# EAGLE design door_sensor (EAGLE 7.3.0)
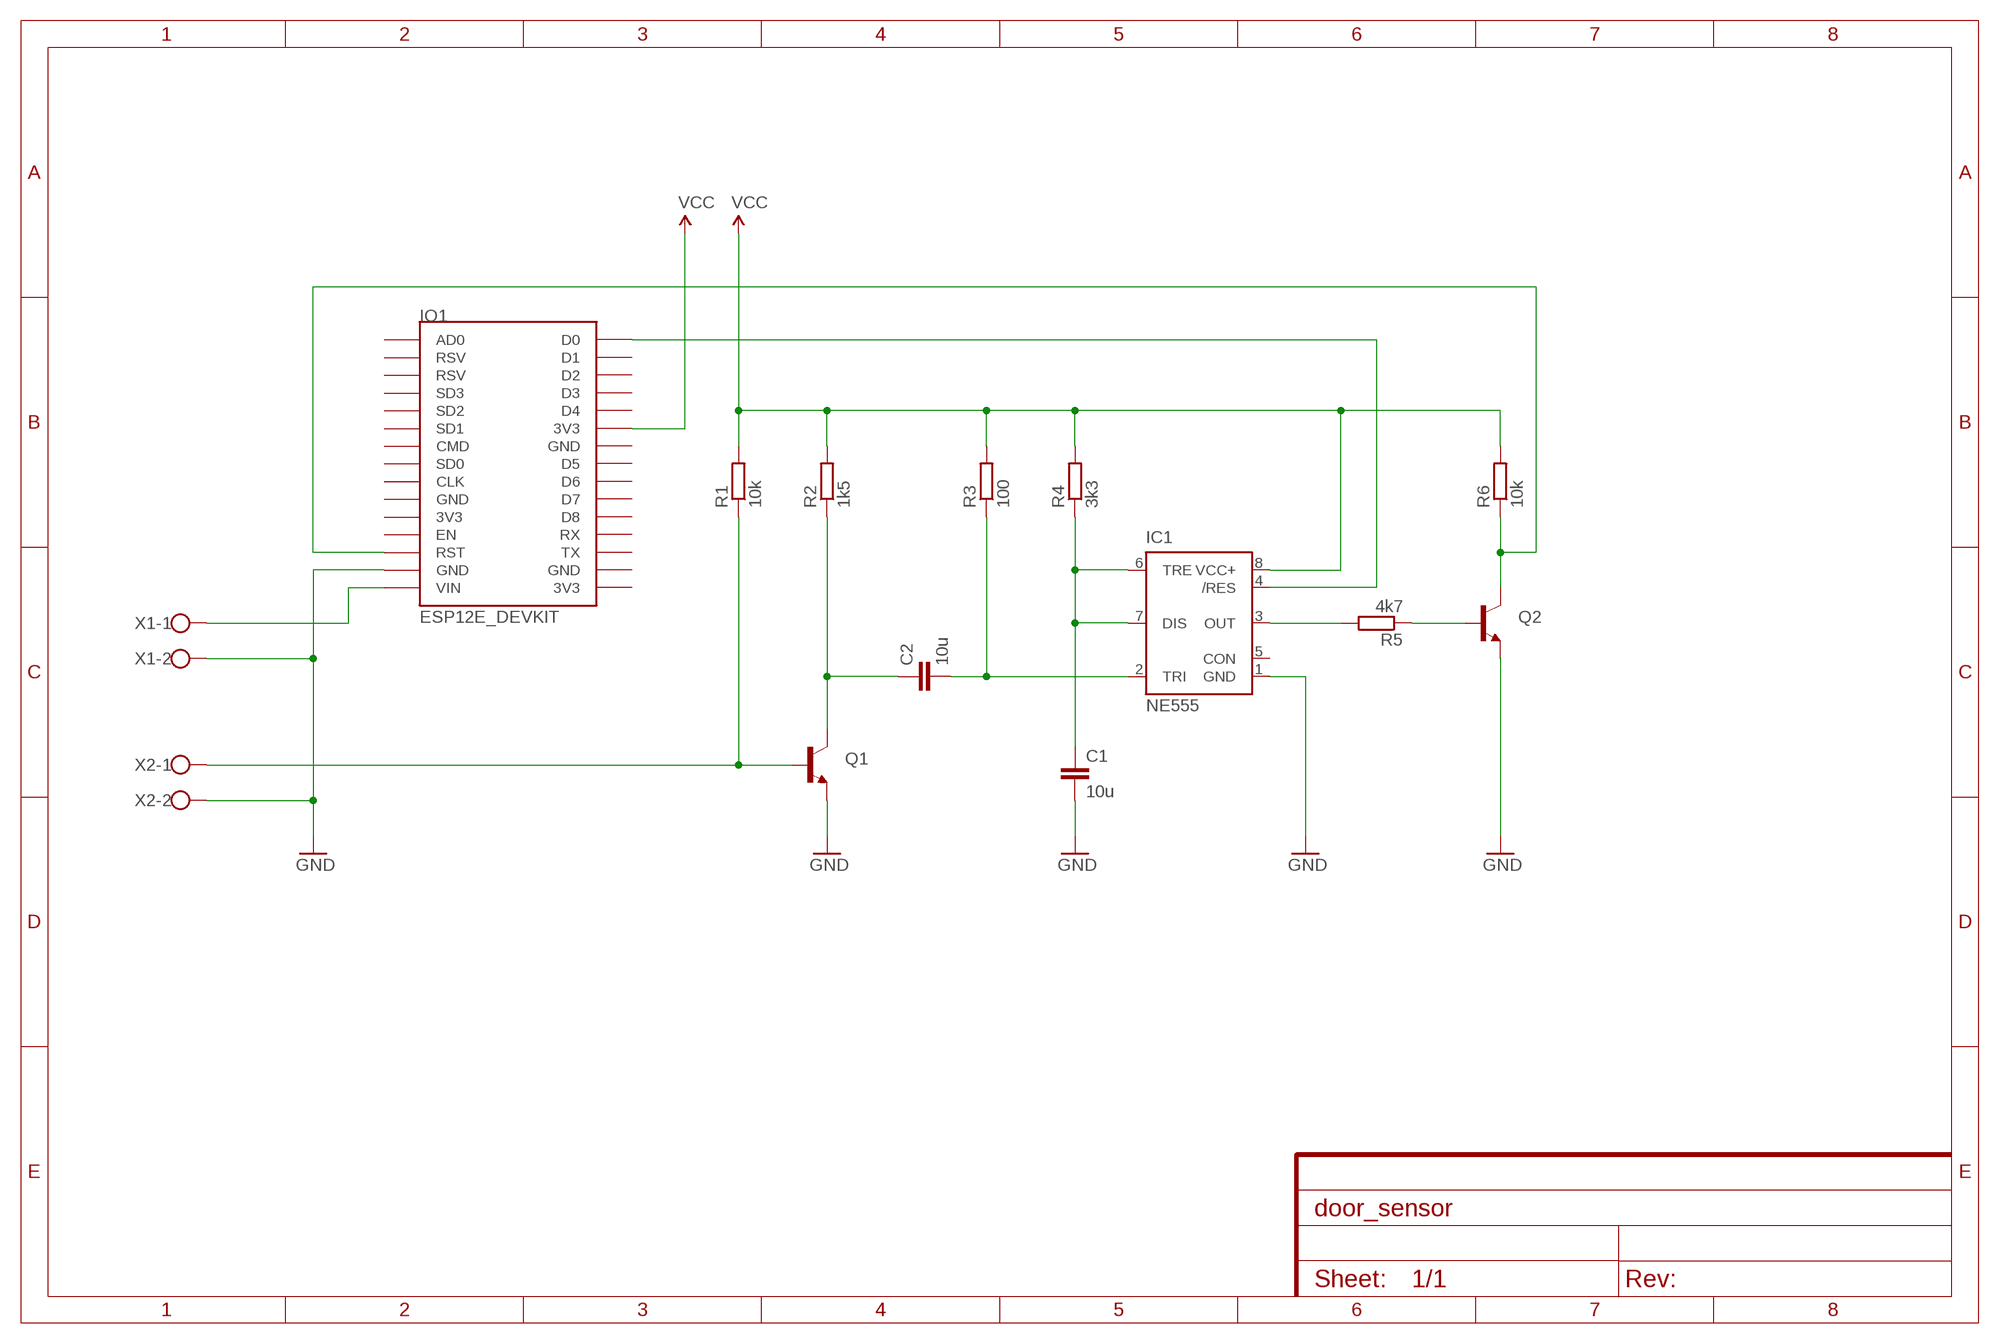
[diagram p0: schematic, sheet 1]
FRAME1 (FRAME-A4L): CNAME: Door sensor; CREVISION: 1; DESIGNER: M.Vagovszky

## Parts
C1  10u  C-EU025-025X050  [C025-025X050]
C2  10u  C-EU025-025X050  [C025-025X050]
IC1  NE555  [DIL-08]
IO1  ESP12E_DEVKIT  [ESP12E_DEVKIT]
Q1  TRANSISTOR_NPN2N3904  [TO-92]
Q2  TRANSISTOR_NPN2N3904  [TO-92]
R1  10k  R-EU_0207/12  [0207/12]
R2  1k5  R-EU_0207/12  [0207/12]
R3  100  R-EU_0207/12  [0207/12]
R4  3k3  R-EU_0207/12  [0207/12]
R5  4k7  R-EU_0207/12  [0207/12]
R6  10k  R-EU_0207/12  [0207/12]
X1  AK550/2  [AK550/2]
X2  AK550/2  [AK550/2]

## Nets
GND: C1.2 IC1.1(GND) IO1.GND@1(GND) Q1.1(E) Q2.1(E) X1.2 X2.2
N$1: C2.1 Q1.3(C) R2.1
N$2: Q1.2(B) R1.1 X2.1
N$3: C2.2 IC1.2(TRI) R3.1
N$4: IO1.VIN X1.1
N$8: IO1.RST Q2.3(C) R6.1
N$9: Q2.2(B) R5.1
N$10: IC1.3(OUT) R5.2
N$11: C1.1 IC1.6(TRE) IC1.7(DIS) R4.1
N$12: IC1.4(/RES) IO1.D0
VCC: IC1.8(VCC+) IO1.3V3@1(3V3) R1.2 R2.2 R3.2 R4.2 R6.2
Unconnected: IC1.5(CON) IO1.3V3@0(3V3) IO1.3V3@2(3V3) IO1.AD0 IO1.CLK IO1.CMD IO1.D1 IO1.D2 IO1.D3 IO1.D4 IO1.D5 IO1.D6 IO1.D7 IO1.D8 IO1.EN IO1.GND@0(GND) IO1.GND@2(GND) IO1.GND@3(GND) IO1.RSV@0(RSV) IO1.RSV@1(RSV) IO1.RX IO1.SD0 IO1.SD1 IO1.SD2 IO1.SD3 IO1.TX

## Library data of the parts
C1 C2 = rcl:C-EU: CAPACITOR, European symbol
IC1 = st-microelectronics:NE555: General purpose bipolar Timer; MF: Arrow Electronics; MPN: NE555N; OC_FARNELL: 1467742; OC_NEWARK: 89K1486
IO1 = esp12e_devkit:ESP12E_DEVKIT: ESP12E DEVKIT BOARD
Q1 Q2 = SparkFun-DiscreteSemi:TRANSISTOR_NPN: Generic NPN BJT MMBT2222A - TRANS-08049 (SOT-23, 1A 40V) MPSA42 - TRANS-09116 (SOT-23, 500mA 300V) MMBT5088LT1G - TRANS-11160 (SOT-23, 50 mA 30V) BC547 - COM-08928 <http://www.sparkfun.com/products/8928> (TO-92 45V 100mA) (1.Collector 2.Base 3.Emitter) 2N3904 - COM-00521 <http://www.sparkfun.com/products/521> (TO-92 40V 200mA) (1.Emitter 2.Base 3.Collector) P2N2222A - COM-12852 <http://www.sparkfun.com/products/12852> (TO-92 40V 600mA) (1.Collector 2.Base 3.Emitter); PROD_ID: TRANS-08447
R1-R6 = rcl:R-EU_: RESISTOR, European symbol
X1 X2 = con-ptr500+:AK550/2: CONNECTOR

## Board
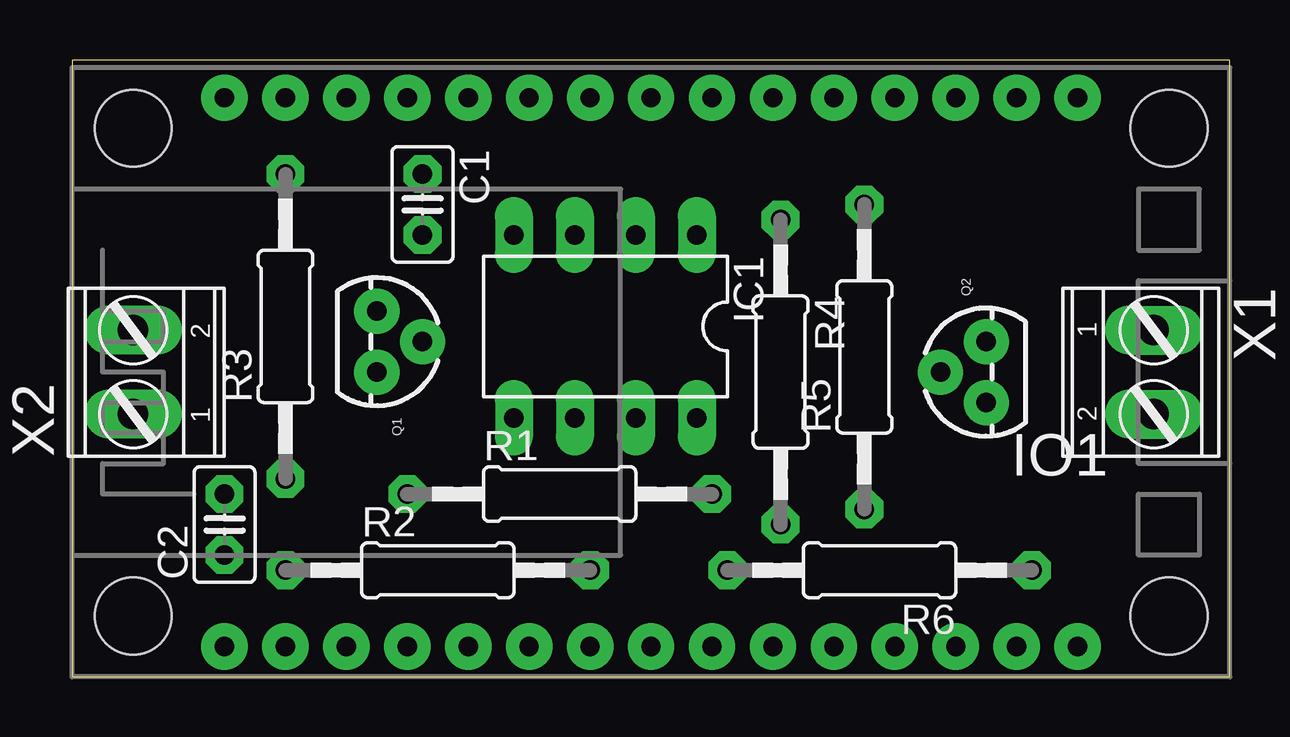
[diagram p1: board, top side]
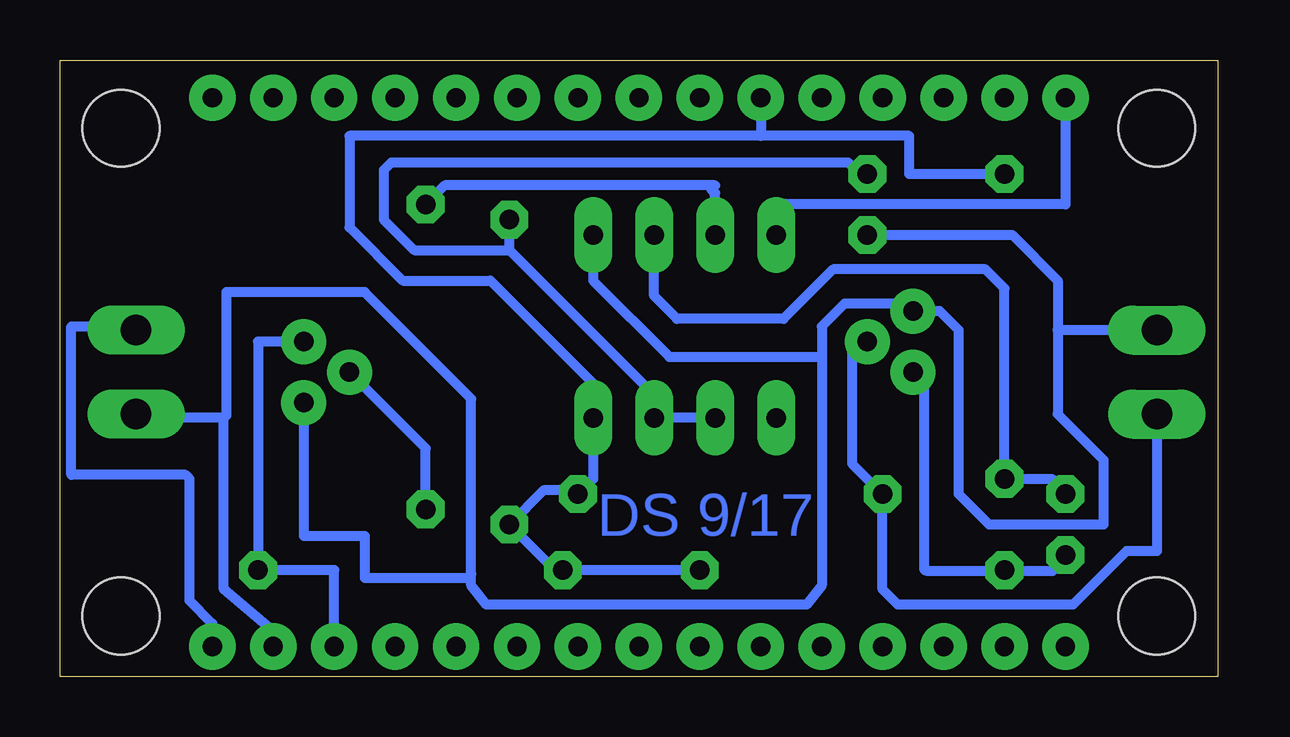
[diagram p2: board, bottom side, seen from below]

Size 48.25 x 25.7 mm. Coordinates in mm from the lower left corner, seen from the top.
Outline: 48.25,0 48.25,25.7 0,25.7 0,0 48.25,0
Copper layers (1*16): Top 0.035mm / dielectric 1.5mm / Bottom 0.035mm
Design rules "default *": minimum track width 10mil, minimum drill 24mil, track to track 8mil, track to pad 8mil, pad to pad 8mil, via to via 8mil, smd to smd 8mil, copper to edge 40mil, drill to drill 8mil, minimum pad ring 15mil, minimum via ring 10mil, stop-mask expansion 4mil, vias tented up to drill 0mil, thermal gap 10mil

### Footprints (pad centres in the part's own frame; a part is rotated, then mirrored left to right if it is on the bottom)
C025-025X050 = drill 0.813 octagon: 1 -1.27,0; 2 1.27,0
DIL-08 = drill 0.813 long: 1 -3.81,-3.81; 2 -1.27,-3.81; 3 1.27,-3.81; 4 3.81,-3.81; 5 3.81,3.81; 6 1.27,3.81; 7 -1.27,3.81; 8 -3.81,3.81
ESP12E_DEVKIT = drill 0.8 pad 1.93: 3V3@0 -11.43,-7.62; 3V3@1 11.43,5.08; 3V3@2 11.43,-17.78; AD0 -11.43,17.78; CLK -11.43,-2.54; CMD -11.43,2.54; D0 11.43,17.78; D1 11.43,15.24; D2 11.43,12.7; D3 11.43,10.16; D4 11.43,7.62; D5 11.43,0; D6 11.43,-2.54; D7 11.43,-5.08; D8 11.43,-7.62; EN -11.43,-10.16; GND@0 -11.43,-5.08; GND@1 -11.43,-15.24; GND@2 11.43,2.54; GND@3 11.43,-15.24; RST -11.43,-12.7; RSV@0 -11.43,15.24; RSV@1 -11.43,12.7; RX 11.43,-10.16; SD0 -11.43,0; SD1 -11.43,5.08; SD2 -11.43,7.62; SD3 -11.43,10.16; TX 11.43,-12.7; VIN -11.43,-17.78 | hole 3.2: -10.16,21.59; 10.16,21.59; 10.16,-21.59; -10.16,-21.59
TO-92 = drill 0.813 pad 1.88: 1 -1.27,0; 2 0,1.905; 3 1.27,0
0207/12 = drill 0.813 octagon: 1 -6.35,0; 2 6.35,0
AK550/2 = drill 1.27 long: 1 -1.75,0; 2 1.75,0

### Placement (x,y rotation side)
C1  14.6,19.68 270 top
C2  6.34,6.35 90 top
IC1  22.21,14.61 180 top
IO1  24.12,12.7 90 top
Q1  12.69,13.97 270 top
Q2  38.09,12.7 90 top
R1  20.31,7.62 0 top
R2  15.23,4.45 0 top
R3  8.88,14.61 90 top
R4  29.52,12.7 270 top
R5  33.01,13.34 90 top
R6  33.65,4.45 180 top
X1  45.08,12.7 270 top
X2  2.53,12.7 90 top

### Tracks (layer width: path | path; a pad name or v marks a point on that pad's centre or on a via)
GND
  Bottom 0.254: 12.82,15.32 Q1.1
  Bottom 0.406: 41.42,10.79 41.32,10.9 41.32,16.03 35.55,16.03 31.1,11.59 31.1,4.29 | 41.42,10.79 44.92,10.79 X1.2 | IO1.GND@1 39.36,1.91 41.42,3.65 41.42,10.79 | 31.1,4.29 31.1,3.81 30.47,3.02 17.13,3.02 16.5,3.81 16.5,13.34 | IC1.1 26.02,16.51 22.85,13.34 16.5,13.34 | 12.82,15.32 12.82,15.37 13.01,15.56 15.55,15.56 16.5,14.61 16.5,13.34 | Q2.1 38.09,5.87 35.55,5.87 35.55,4.13 31.26,4.13 31.1,4.29 | X2.2 6.65,14.45 6.66,14.45 | 6.66,14.45 6.66,10.95 4.75,9.05 4.75,6.35 9.52,6.35 10.79,7.62 10.79,14.45 11.58,15.24 Q1.1 | C1.2 8.56,18.41 6.66,16.51 6.66,14.45
N$1
  Bottom 0.254: 8.7,4.41 R2.1 | 6.42,5.03 C2.1
  Bottom 0.406: 6.42,5.03 6.87,4.41 8.7,4.41 12.09,4.41 12.21,4.45 12.21,12.22 Q1.3
N$2
  Bottom 0.406: 2.37,10.79 X2.1 2.53,5.24 3.8,5.24 6.02,3.02 13.33,3.02 13.96,3.65 R1.1 15.23,8.89 15.23,13.49 14.75,13.97 Q1.2
N$3
  Bottom 0.254: 8.7,8.23 R3.1 | 6.42,7.77 C2.2
  Bottom 0.406: 8.7,8.23 6.87,8.23 6.42,7.77 | R3.1 8.88,16.19 9.67,16.99 16.02,16.99 18.09,14.92 22.53,14.92 23.48,15.88 IC1.2
N$4
  Bottom 0.406: IO1.VIN 41.9,2.22 42.85,3.17 42.85,8.26 43.01,8.41 47.77,8.41 47.77,14.61 45.23,14.61 X1.1
N$8
  Bottom 0.254: 39.79,4.34 R6.1 | 36.82,1.37 IO1.RST
  Bottom 0.406: 36.82,1.37 36.82,4.45 R6.1 40,13.97 Q2.3
N$9
  Bottom 0.406: R5.1 33.01,9.53 Q2.2
N$10
  Bottom 0.406: IC1.3 20.94,20.16 21.1,20.32 20.94,20.48 32.22,20.48 R5.2
N$11
  Bottom 0.254: 23.56,10.97 IC1.7
  Bottom 0.406: 23.56,10.97 23.56,11.82 29.52,17.78 | 29.52,17.78 R4.1 | C1.1 14.91,20.95 15.39,21.43 34.44,21.43 34.76,21.11 34.76,19.05 33.49,17.78 29.52,17.78 | IC1.6 IC1.7
N$12
  Bottom 0.254: 18.3,18.52 IC1.4
  Bottom 0.406: IC1.4 18.4,19.68 6.34,19.68 IO1.D0
VCC
  Bottom 0.254: 26.76,7.77 R1.2
  Bottom 0.406: R2.2 R6.2 27.61,4.45 R4.2 28.09,7.77 26.76,7.77 | R1.2 26.02,8.26 IC1.8 25.87,10.95 25.87,12.06 30.31,16.51 33.96,16.51 36.19,18.73 36.19,22.54 19.04,22.54 | R3.2 12.85,20.95 12.85,22.54 19.04,22.54 | IO1.3V3@1 19.04,22.54

### Text on the board
Bottom: DS 9/17